# Altium schematic sheet Top.SchDoc
size B; DocumentNumber: 5; Revision: 1.1; SheetNumber: 1; SheetTotal: 4
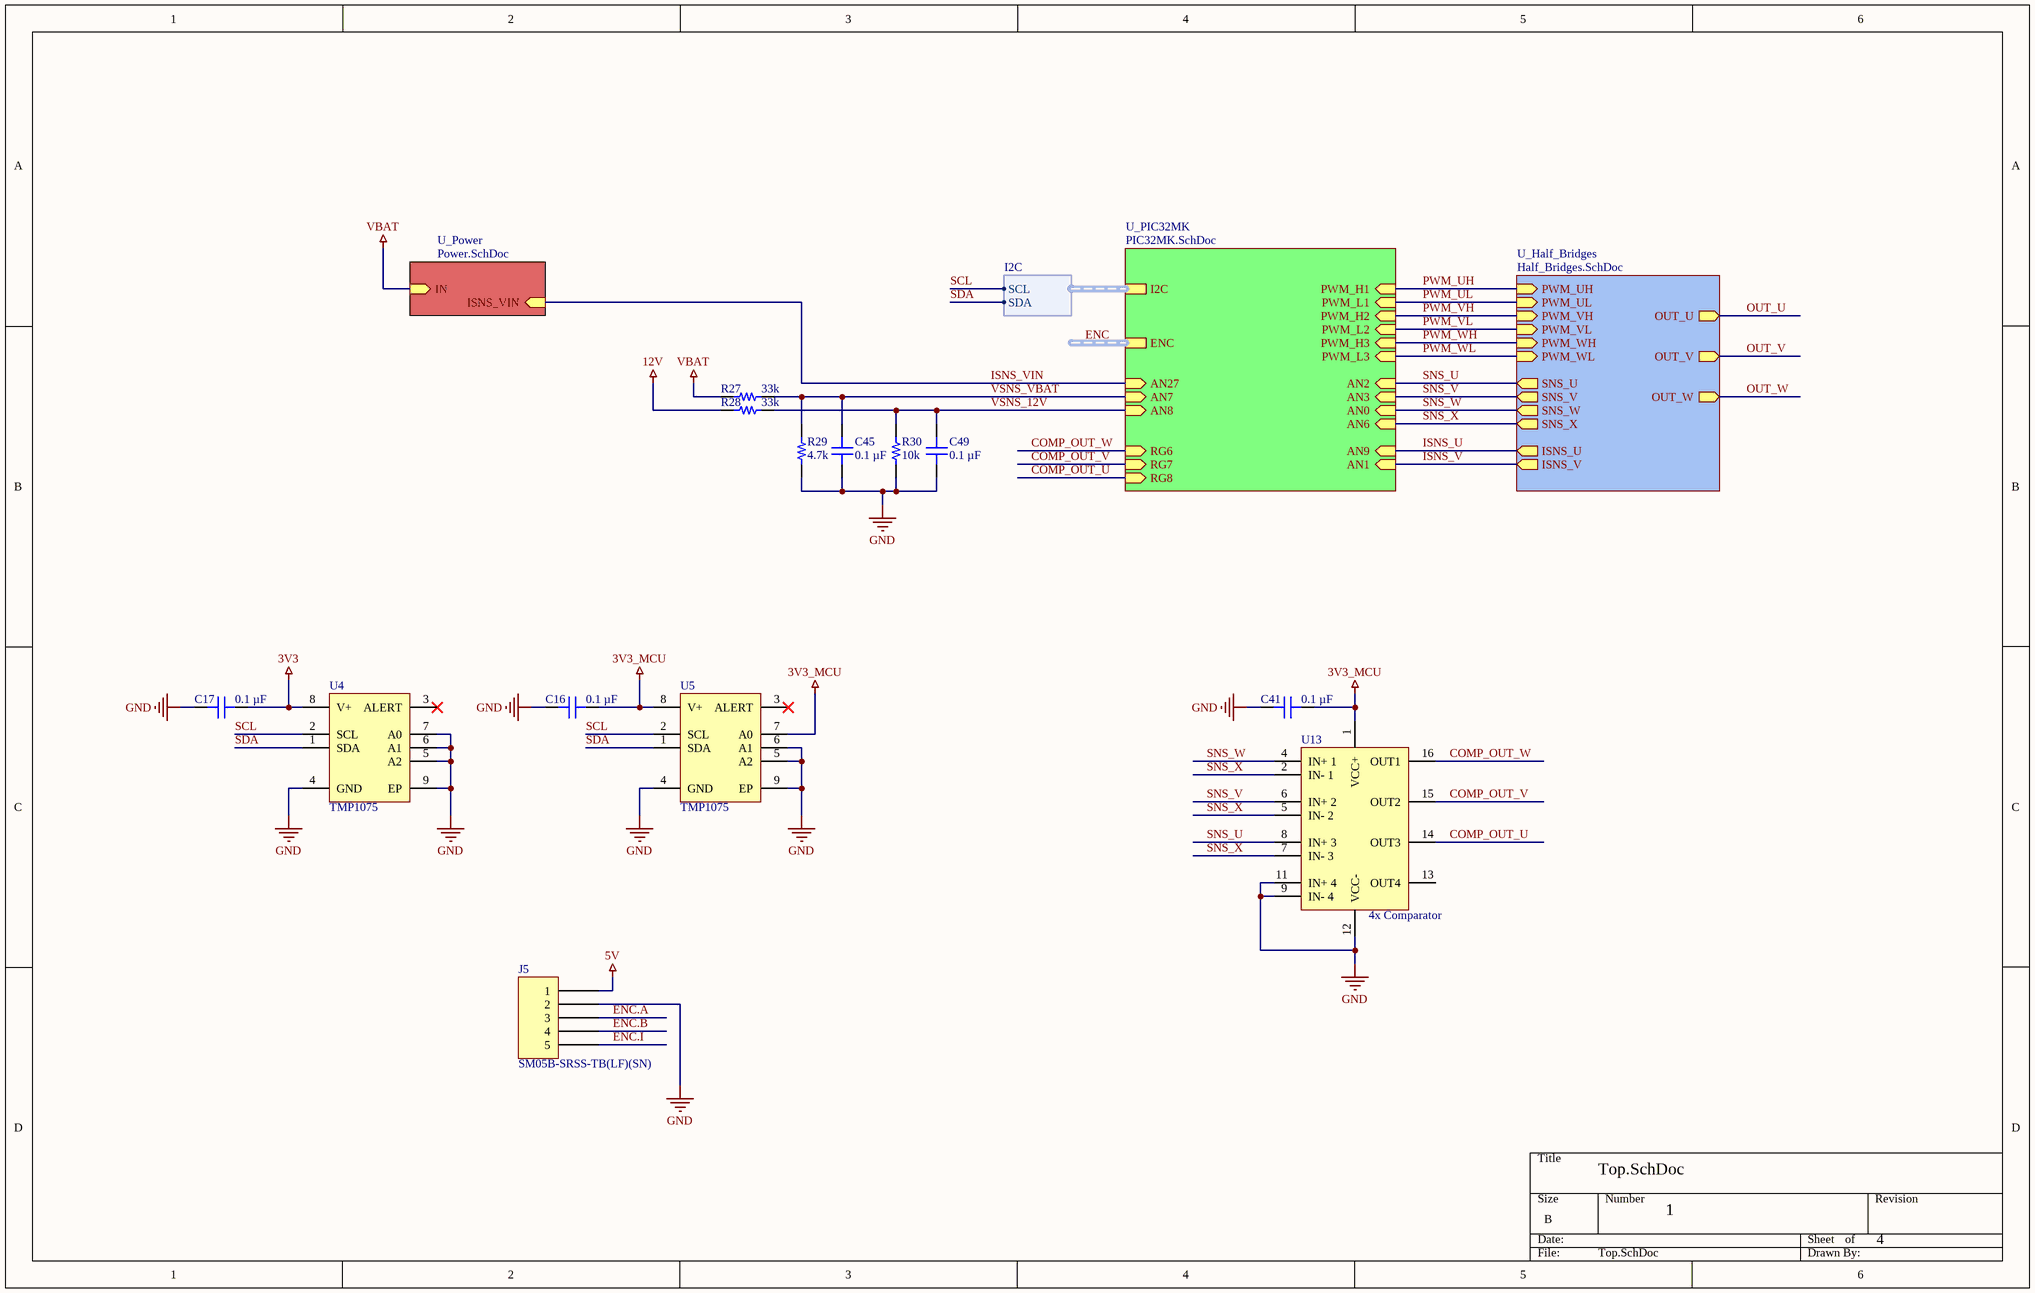
[diagram p0: Top.SchDoc]

## Parts
C16  0.1 µF  [CAP 0402_1005]
C17  0.1 µF  [CAP 0402_1005]
C41  0.1 µF  [CAP 0402_1005]
C45  0.1 µF  [CAP 0402_1005]
C49  0.1 µF  [CAP 0402_1005]
J5  SM05B-SRSS-TB(LF)(SN)  [JST SM05B-SRSS-TB]
R27  33k  [RES 0402_1005]
R28  33k  [RES 0402_1005]
R29  4.7k  [RES 0402_1005]
R30  10k  [RES 0402_1005]
U4  TMP1075  [8_WSON_2x2_0.5mm]
U5  TMP1075  [8_WSON_2x2_0.5mm]
U13  4x Comparator  [QFN50P300X300X100-16N]

## Sub-sheets
U_Half_Bridges = Half_Bridges.SchDoc: PWM_UH (in), PWM_UL (in), PWM_VH (in), PWM_VL (in), PWM_WH (in), PWM_WL (in), SNS_U (out), SNS_V (out), SNS_W (out), SNS_X (out), OUT_U (out), OUT_V (out), OUT_W (out), ISNS_U (out), ISNS_V (out)
U_PIC32MK = PIC32MK.SchDoc: I2C (harness I2C), PWM_L1 (in), PWM_H1 (in), PWM_L2 (in), PWM_H2 (in), PWM_L3 (in), PWM_H3 (in), ENC (harness ENC), AN9 (in), AN1 (in), AN6 (in), AN2 (in), AN3 (in), AN0 (in), RG6 (in), RG7 (in), RG8 (in), AN7 (in), AN8 (in), AN27 (in)
U_Power = Power.SchDoc: IN (in), ISNS_VIN (in)

## Harnesses
I2C: SCL, SDA

## Nets
3V3: C17.2 U4.8(V+)
3V3_MCU: C16.2 C41.2 U5.7(A0) U5.8(V+) U13.1(VCC+)
5V: J5.1
12V: R28.2
GND: C16.1 C17.1 C41.1 C45.1 C49.1 J5.2 R29.2 R30.2 U4.4(GND) U4.5(A2) U4.6(A1) U4.7(A0) U4.9(EP) U5.4(GND) U5.5(A2) U5.6(A1) U5.9(EP) U13.9(IN-_4) U13.11(IN+_4) U13.12(VCC-)
VBAT: R27.2 ; sheet U_Power/IN
COMP_OUT_U: U13.14(OUT3) ; sheet U_PIC32MK/RG8
COMP_OUT_V: U13.15(OUT2) ; sheet U_PIC32MK/RG7
COMP_OUT_W: U13.16(OUT1) ; sheet U_PIC32MK/RG6
ENC.A: J5.3
ENC.B: J5.4
ENC.I: J5.5
ISNS_U: sheet U_PIC32MK/AN9, sheet U_Half_Bridges/ISNS_U
ISNS_V: sheet U_PIC32MK/AN1, sheet U_Half_Bridges/ISNS_V
ISNS_VIN: sheet U_PIC32MK/AN27, sheet U_Power/ISNS_VIN
OUT_U: sheet U_Half_Bridges/OUT_U
OUT_V: sheet U_Half_Bridges/OUT_V
OUT_W: sheet U_Half_Bridges/OUT_W
PWM_UH: sheet U_PIC32MK/PWM_H1, sheet U_Half_Bridges/PWM_UH
PWM_UL: sheet U_PIC32MK/PWM_L1, sheet U_Half_Bridges/PWM_UL
PWM_VH: sheet U_PIC32MK/PWM_H2, sheet U_Half_Bridges/PWM_VH
PWM_VL: sheet U_PIC32MK/PWM_L2, sheet U_Half_Bridges/PWM_VL
PWM_WH: sheet U_PIC32MK/PWM_H3, sheet U_Half_Bridges/PWM_WH
PWM_WL: sheet U_PIC32MK/PWM_L3, sheet U_Half_Bridges/PWM_WL
SCL: U4.2(SCL) U5.2(SCL) ; sheet U_PIC32MK/I2C.SCL
SDA: U4.1(SDA) U5.1(SDA) ; sheet U_PIC32MK/I2C.SDA
SNS_U: U13.8(IN+_3) ; sheet U_PIC32MK/AN2, sheet U_Half_Bridges/SNS_U
SNS_V: U13.6(IN+_2) ; sheet U_PIC32MK/AN3, sheet U_Half_Bridges/SNS_V
SNS_W: U13.4(IN+_1) ; sheet U_PIC32MK/AN0, sheet U_Half_Bridges/SNS_W
SNS_X: U13.2(IN-_1) U13.5(IN-_2) U13.7(IN-_3) ; sheet U_PIC32MK/AN6, sheet U_Half_Bridges/SNS_X
VSNS_12V: C49.2 R28.1 R30.1 ; sheet U_PIC32MK/AN8
VSNS_VBAT: C45.2 R27.1 R29.1 ; sheet U_PIC32MK/AN7

Not connected (* = marked no-connect by the designer): U4 3(ALERT)*; U5 3(ALERT)*; U13 13(OUT4)

## Buses and harness runs
harness ENC = sheet U_PIC32MK/ENC

## Library data of the parts
C16 C17 C41 C45 C49 = C0402C104K4RACAUTO: CAP CER 0.1UF 16V X7R 0402; manufacturer: KEMET; Tolerance: ±10%; Part Number: C0402C104K4RACAUTO; Value: 0.1 µF; Applications: Automotive, Bypass, Decoupling; Capacitance: 0.1 µF; componentlink1description: Datasheet; componentlink1url: https://api.kemet.com/component-edge/download/specsheet/C0402C104K4RACAUTO.pdf; componentlink2description: DigiKey Link; componentlink2url: https://www.digikey.com/en/products/detail/kemet/C0402C104K4RACAUTO/3314827; Device Package: 0402 (1005 Metric); lastupdated: 8/14/2022 9:05:51 PM; Lifecycle Status: Active; Minimum Order: 1; Mounting Type: Surface Mount, MLCC; Operating Temperature: -55°C ~ 125°C; Package / Case: 0402 (1005 Metric); packaging: TapeAndReel; partid: 3024; Part Status: Active; price: 0.01; Ratings: AEC-Q200; series: SMD Auto X7R; Size / Dimension: 0.039" L x 0.020" W (1.00mm x 0.50mm); Supplier 1: DigiKey; Supplier Part Number 1: 399-6828-1-ND; Temperature Coefficient: X7R; Thickness (Max): 0.022" (0.55mm); Voltage - Rated: 16V
J5 = SM05B-SRSS-TB(LF)(SN): CONN HEADER SMD R/A 5POS 1MM; Manufacturer: JST Sales America Inc.; Current Rating (Amps): 0.7A; Material Flammability Rating: UL94 V-0; Number of Positions: 5; Number of Positions Loaded: All; Pitch - Mating: 0.039" (1.00mm); Shrouding: Shrouded - 4 Wall; Style: Board to Cable/Wire; Voltage Rating: 50V; Part Number: SM05B-SRSS-TB(LF)(SN); ComponentLink1Description: Datasheet; ComponentLink1URL: http://www.jst-mfg.com/product/pdf/eng/eSH.pdf; ComponentLink2Description: DigiKey Link; ComponentLink2URL: http://digikey.com/product-detail/en/jst-sales-america-inc/SM05B-SRSS-TB-LF-SN/455-1805-1-ND/926876; Connector Type: Header; Contact Finish - Mating: Tin; Contact Finish - Post: Tin; Contact Material: Copper Alloy; Contact Shape: Square; Contact Type: Male Pin; Fastening Type: Push-Pull; Features: Solder Retention; Insulation Color: Natural; Insulation Height: 0.114" (2.90mm); Insulation Material: Polyamide (PA), Nylon; LastUpdated: 1/12/2020 11:42:04 PM; Lifecycle Status: Active; Minimum Order: 1; Mounting Type: Surface Mount, Right Angle; Number of Rows: 1; Operating Temperature: -25°C ~ 85°C; Packaging: TapeAndReel; PartId: 63; Part Status: Active; Price: 0.32; Series: SR; Supplier 1: DigiKey; Supplier Part Number 1: 455-1805-1-ND; Termination: Solder
R27-R30 = RK73H1ETTP1432F: RES 14.3K OHM 1% 1/10W 0402; Manufacturer: KOA Speer Electronics, Inc.; Power (Watts): 0.1W, 1/10W; Resistance: 14.3 kOhms; Temperature Coefficient: ±100ppm/°C; Part Number: RK73H1ETTP1432F; ComponentLink1Description: Datasheet; ComponentLink1URL: http://www.koaspeer.com/catimages/Products/RK73H/RK73H.pdf; ComponentLink2Description: DigiKey Link; ComponentLink2URL: https://www.digikey.com/en/products/detail/koa-speer-electronics-inc/RK73H1ETTP1432F/9844351; Composition: Thick Film; Device Package: 0402 (1005 Metric); Features: Automotive AEC-Q200, Moisture Resistant; Height - Seated (Max): 0.016" (0.40mm); LastUpdated: 8/14/2022 9:23:49 PM; Lifecycle Status: Active; Minimum Order: 1; Number of Terminations: 2; Operating Temperature: -55°C ~ 155°C; Package / Case: 0402 (1005 Metric); Packaging: CutTape; PartId: 10193; Part Status: Active; Price: 0.01; Ratings: AEC-Q200; Series: RK73H; Size / Dimension: 0.039" L x 0.020" W (1.00mm x 0.50mm); Supplier 1: DigiKey; Supplier Part Number 1: 2019-RK73H1ETTP1432FCT-ND; Supplier Device Package: 0402; Tolerance: ±1%
  R27 R28: Value: 33k
  R29: Value: 4.7k
  R30: Value: 10k
U4 U5 = TMP1075: I2C TEMP SENSOR
U13 = LM2901Q4T: Comparator General Purpose CMOS, DTL, MOS, Open-Collector, TTL 16-QFN (3x3)